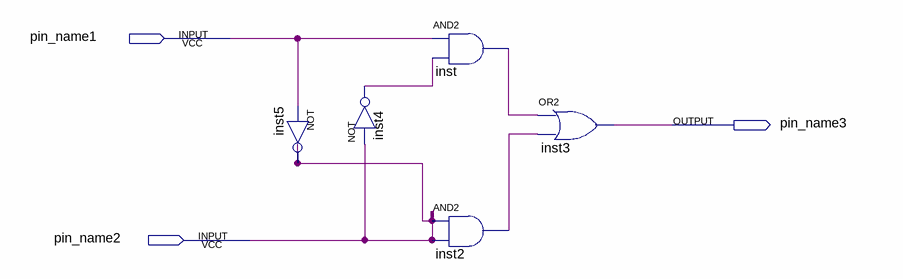
[diagram p0: schematic sheet]
// Quartus schematic Light diagram.bdf as structural Verilog: 5 symbols, 3 pins
module \Light_diagram  (
  input  pin_name1,
  input  pin_name2,
  output pin_name3
);

  wire inst2_out, inst4_out, inst_out;

  not inst5 (pin_name2, pin_name1);
  not inst4 (inst4_out, pin_name2);
  and inst (inst_out, pin_name1, inst4_out);
  and inst2 (inst2_out, pin_name2, pin_name2);
  or inst3 (pin_name3, inst_out, inst2_out);
endmodule
